# Altium schematic sheet dac.SchDoc: External DAC
size A4; SheetNumber: 7; SheetTotal: 21
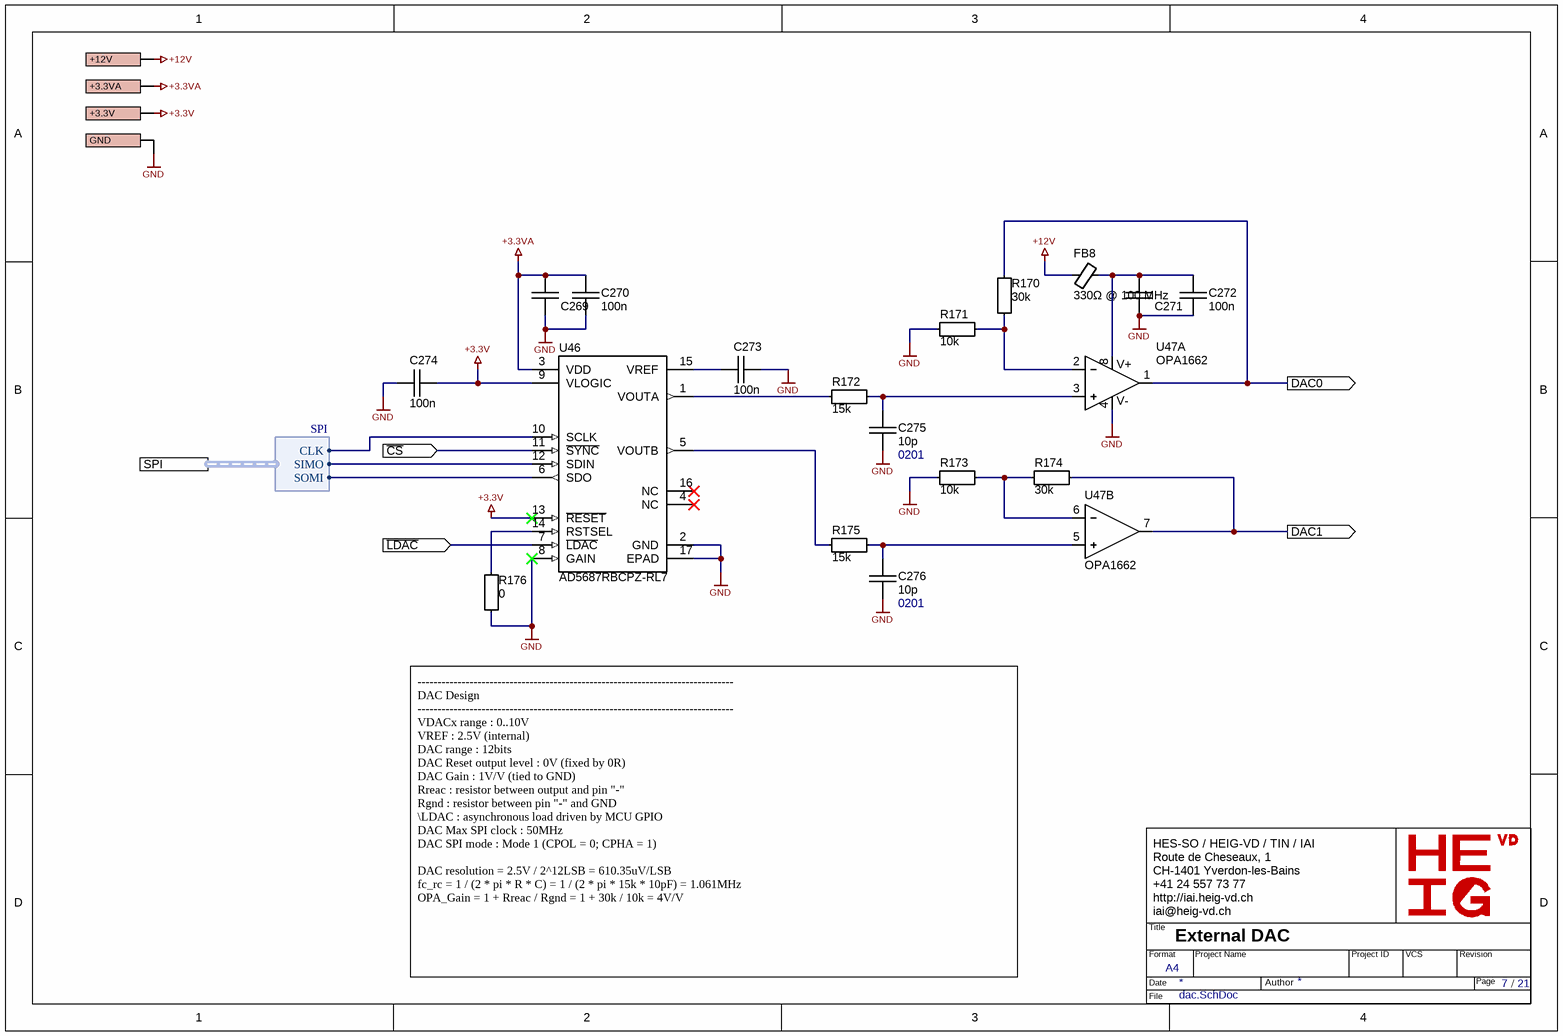
[diagram p0: dac.SchDoc]

## Parts
C269  10u  [SM/C0402]  (value not drawn)
C270  100n  [SM/C0402]
C271  10u  [SM/C0402]  (value not drawn)
C272  100n  [SM/C0402]
C273  100n  [SM/C0402]
C274  100n  [SM/C0402]
C275  10p  Case: 0201  [SM/C0201]
C276  10p  Case: 0201  [SM/C0201]
FB8  value 330Ω @ 100 MHz  [SM/L0603]  (hidden comment: BLM18KG331SN1D)
R170  30k  [SM/R0402]
R171  10k  [SM/R0402]
R172  15k  [SM/R0402]
R173  10k  [SM/R0402]
R174  30k  [SM/R0402]
R175  15k  [SM/R0402]
R176  0  [SM/R0402]
U46  AD5687RBCPZ-RL7  [QFN50P300X300X80_HS-17N]
U47  OPA1662  [SOIC8]  (parts A,B of 2)

## Ports
+3.3V, +3.3VA, +12V, DAC0 (out), DAC1 (out), GND, SPI (harness SPI), ~{CS} (in), ~{LDAC} (in)

## Harnesses
SPI: CLK, SIMO, SOMI

## Nets
+3.3V: C274.1 U46.9(VLOGIC) U46.13(~{RESET}) ; port +3.3V
+3.3VA: C269.1 C270.1 U46.3(VDD) ; port +3.3VA
+12V: FB8.1 ; port +12V
GND: C269.2 C270.2 C271.2 C272.2 C273.2 C274.2 C275.2 C276.2 R171.1 R173.1 R176.1 U46.2(GND) U46.8(GAIN) U46.17(EPAD) U47.4(V-) ; port GND
~{CS}: U46.11(~{SYNC}) ; port ~{CS}
~{LDAC}: U46.7(~{LDAC}) ; port ~{LDAC}
DAC0: R170.2 U47.1(OUT) ; port DAC0
DAC1: R174.2 U47.7(OUT) ; port DAC1
NetC271_1: C271.1 C272.1 FB8.2 U47.8(V+)
NetC273_1: C273.1 U46.15(VREF)
NetC275_1: C275.1 R172.2 U47.3(IN+)
NetC276_1: C276.1 R175.2 U47.5(IN+)
NetR170_1: R170.1 R171.2 U47.2(IN-)
NetR172_1: R172.1 U46.1(VOUTA)
NetR173_2: R173.2 R174.1 U47.6(IN-)
NetR175_1: R175.1 U46.5(VOUTB)
NetR176_2: R176.2 U46.14(RSTSEL)
NetU46_6: U46.6(SDO) ; port SPI.SOMI
NetU46_10: U46.10(SCLK) ; port SPI.CLK
NetU46_12: U46.12(SDIN) ; port SPI.SIMO

Not connected (* = marked no-connect by the designer): U46 4(NC)* 16(NC)*

## Notes on the sheet
- -------------------------------------------------------------------------------
  DAC Design
  -------------------------------------------------------------------------------
  VDACx range : 0..10V
  VREF : 2.5V (internal)
  DAC range : 12bits
  DAC Reset output level : 0V (fixed by 0R)
  DAC Gain : 1V/V (tied to GND)
  Rreac : resistor between output and pin "-"
  Rgnd : resistor between pin "-" and GND
  \LDAC : asynchronous load driven by MCU GPIO
  DAC Max SPI clock : 50MHz
  DAC SPI mode : Mode 1 (CPOL = 0; CPHA = 1)
  DAC resolution = 2.5V / 2^12LSB = 610.35uV/LSB
  fc_rc = 1 / (2 * pi * R * C) = 1 / (2 * pi * 15k * 10pF) = 1.061MHz
  OPA_Gain = 1 + Rreac / Rgnd = 1 + 30k / 10k = 4V/V
- HES-SO / HEIG-VD / TIN / IAI
  Route de Cheseaux, 1
  CH-1401 Yverdon-les-Bains
  +41 24 557 73 77
  http://iai.heig-vd.ch
  iai@heig-vd.ch
- Title
- Format
- Date
- A4
- Project Name
- Author
- Project ID
- VCS
- Revision
- Page
- /
- File

## Library data of the parts
C269 C271 = CAP CER 10UF 6.3V X5R 0402: 10 µF ±20% 6.3V Ceramic Capacitor X5R 0402 (1005 Metric); Supplier 1: Digi-Key; Supplier Part Number 1: 490-GRM155R60J106ME05JCT-ND; Value: 10u; Voltage: 6.3V; Dielectric: X5R
C270 C272-C274 = CAP CER 100NF 25V X5R 0402: 100 nF ±10% 25V Ceramic Capacitor X5R 0402 (1005 Metric); Voltage: 25V; Dielectric: X5R; Supplier 1: Digi-Key; Supplier Part Number 1: 1276-1043-1-ND; Value: 100n
C275 C276 = CAP CER 10PF 25V C0G/NP0 0201: 10 pF ±5% 25V Ceramic Capacitor C0G, NP0 0201 (0603 Metric); Dielectric: X7R; Voltage: 25V; Supplier 1: Digi-Key; Supplier Part Number 1: 490-8607-1-ND; Value: 10p
FB8 = FERRITE BEAD 330 OHM 0603 1LN: 330 Ohms @ 100 MHz 1 Power Line Ferrite Bead 0603 (1608 Metric) 1.7A 80mOhm; Supplier 1: Digi-Key; Supplier Part Number 1: 490-5256-1-ND
R170 R174 = RES 30K OHM 1% 1/16W 0402: 30 kOhms ±1% 0.063W, 1/16W Chip Resistor 0402 (1005 Metric) Moisture Resistant Thick Film; Supplier 1: Digi-Key; Supplier Part Number 1: 311-30.0KLRCT-ND; Value: 30k
R171 R173 = RES 10K OHM 1% 1/16W 0402: 10 kOhms ±1% 0.063W, 1/16W Chip Resistor 0402 (1005 Metric) Moisture Resistant Thick Film; Supplier 1: Digi-Key; Supplier Part Number 1: 1276-3431-1-ND; Value: 10k
R172 R175 = RES 15K OHM 1% 1/16W 0402: 15 kOhms ±1% 0.063W, 1/16W Chip Resistor 0402 (1005 Metric) Thick Film; Value: 15k; Supplier 1: Digi-Key; Supplier Part Number 1: 13-RC0402FR-1015KLCT-ND
R176 = RES SMD 0 OHM JUMPER 1/10W 0402: 0 Ohms Jumper Chip Resistor 0402 (1005 Metric) Automotive AEC-Q200 Thick Film; Supplier 1: Digi-Key; Supplier Part Number 1: P0.0JCT-ND; Value: 0
U46 = AD5687RBCPZ-RL7: 12 Bit Digital to Analog Converter 2 16-LFCSP (3x3); Supplier 1: Digi-Key; Supplier Part Number 1: 505-AD5687RBCPZ-RL7CT-ND
U47 = OPA1662: Dual operational amplifier; Supplier 1: Digi-Key; Supplier Part Number 1: 296-36692-1-ND